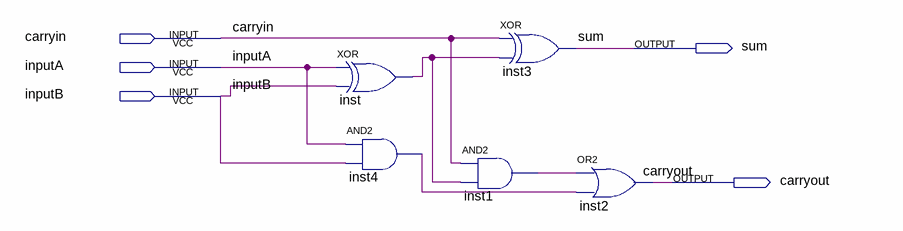
[diagram p0: schematic sheet]
// Quartus schematic fulladder.bdf as structural Verilog: 5 symbols, 5 pins
module fulladder (
  input  carryin,
  input  inputA,
  input  inputB,
  output sum,
  output carryout
);

  wire inst1_out, inst4_out, inst_out;

  xor inst (inst_out, inputA, inputB);
  and inst4 (inst4_out, inputA, inputB);
  and inst1 (inst1_out, carryin, inst_out);
  xor inst3 (sum, carryin, inst_out);
  or inst2 (carryout, inst1_out, inst4_out);
endmodule
